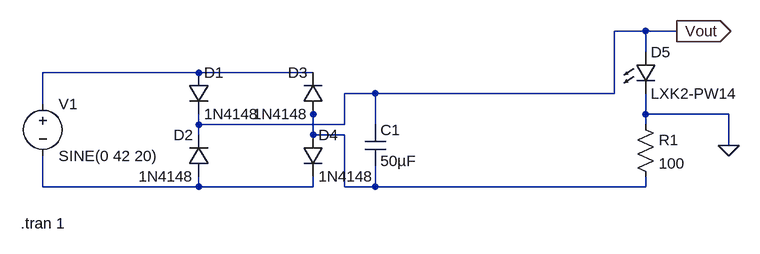
[diagram p0: schematic ElectricalSimulation.asc]
ElectricalSimulation.asc, the LTspice schematic file:
Version 4
SHEET 1 1412 680
WIRE 944 0 896 0
WIRE 992 0 944 0
WIRE 944 32 944 0
WIRE 256 64 16 64
WIRE 432 64 256 64
WIRE 528 96 480 96
WIRE 896 96 896 0
WIRE 896 96 528 96
WIRE 16 112 16 64
WIRE 432 128 432 112
WIRE 944 128 944 96
WIRE 1072 128 944 128
WIRE 256 144 256 128
WIRE 480 144 480 96
WIRE 480 144 256 144
WIRE 528 144 528 96
WIRE 944 144 944 128
WIRE 256 160 256 144
WIRE 432 160 432 128
WIRE 480 160 432 160
WIRE 1072 176 1072 128
WIRE 16 240 16 192
WIRE 256 240 256 224
WIRE 256 240 16 240
WIRE 432 240 432 224
WIRE 432 240 256 240
WIRE 480 240 480 160
WIRE 528 240 528 208
WIRE 528 240 480 240
WIRE 944 240 944 224
WIRE 944 240 528 240
FLAG 1072 176 0
FLAG 992 0 Vout
IOPIN 992 0 Out
SYMBOL voltage 16 96 R0
WINDOW 123 0 0 Left 2
WINDOW 39 0 0 Left 2
SYMATTR InstName V1
SYMATTR Value SINE(0 42 20)
SYMBOL cap 512 144 R0
SYMATTR InstName C1
SYMATTR Value 50µF
SYMBOL diode 240 64 R0
SYMATTR InstName D1
SYMATTR Value 1N4148
SYMBOL diode 272 224 R180
WINDOW 0 24 64 Left 2
WINDOW 3 24 0 Left 2
SYMATTR InstName D2
SYMATTR Value 1N4148
SYMBOL diode 448 128 R180
WINDOW 0 24 64 Left 2
WINDOW 3 24 0 Left 2
SYMATTR InstName D3
SYMATTR Value 1N4148
SYMBOL diode 416 160 R0
SYMATTR InstName D4
SYMATTR Value 1N4148
SYMBOL LED 928 32 R0
SYMATTR InstName D5
SYMATTR Value LXK2-PW14
SYMATTR Description Diode
SYMATTR Type diode
SYMBOL res 928 128 R0
SYMATTR InstName R1
SYMATTR Value 100
TEXT -18 296 Left 2 !.tran 1

The netlist it stands for:
* ElectricalSimulation.asc
V1 N001 N003 SINE(0 42 20)
C1 Vout N002 50µF
D1 N001 Vout 1N4148
D2 N003 Vout 1N4148
D3 N002 N001 1N4148
D4 N002 N003 1N4148
D5 Vout 0 LXK2-PW14
R1 0 N002 100
.model D D
.lib standard.dio
.tran 1
.backanno
.end